# EasyEDA Pro project ProPrj_CH634X-PD-R0-1v1_2025-08-08(1).epro, schematic CH634X-PD-R0-1v1A
Board Name: CH634X-PD-R0-1v1A; Create Date: 2025-07-20; Page Name: CH634X-PD-R0-1v1A; Project Name: CH634X-PD-R0-1v1A; Schematic Name: CH634X-PD-R0-1v1A; Update Date: 2025-08-05; Address1: *; Address2: *; Address3: *; Address4: *; Application_BuildNumber: *; ApprovedBy: *; Author: *; CheckedBy: *; CompanyName: *; CurrentDate: *; CurrentTime: *; Date: *; DocumentFullPathAndName: *; DocumentName: *; DocumentNumber: *; DrawnBy: *; Engineer: *; ImagePath: *; ModifiedDate: *; Organization: *; ProjectName: *; Revision: *; Rule: *; SheetNumber: *; SheetTotal: *; Time: *; Title: *
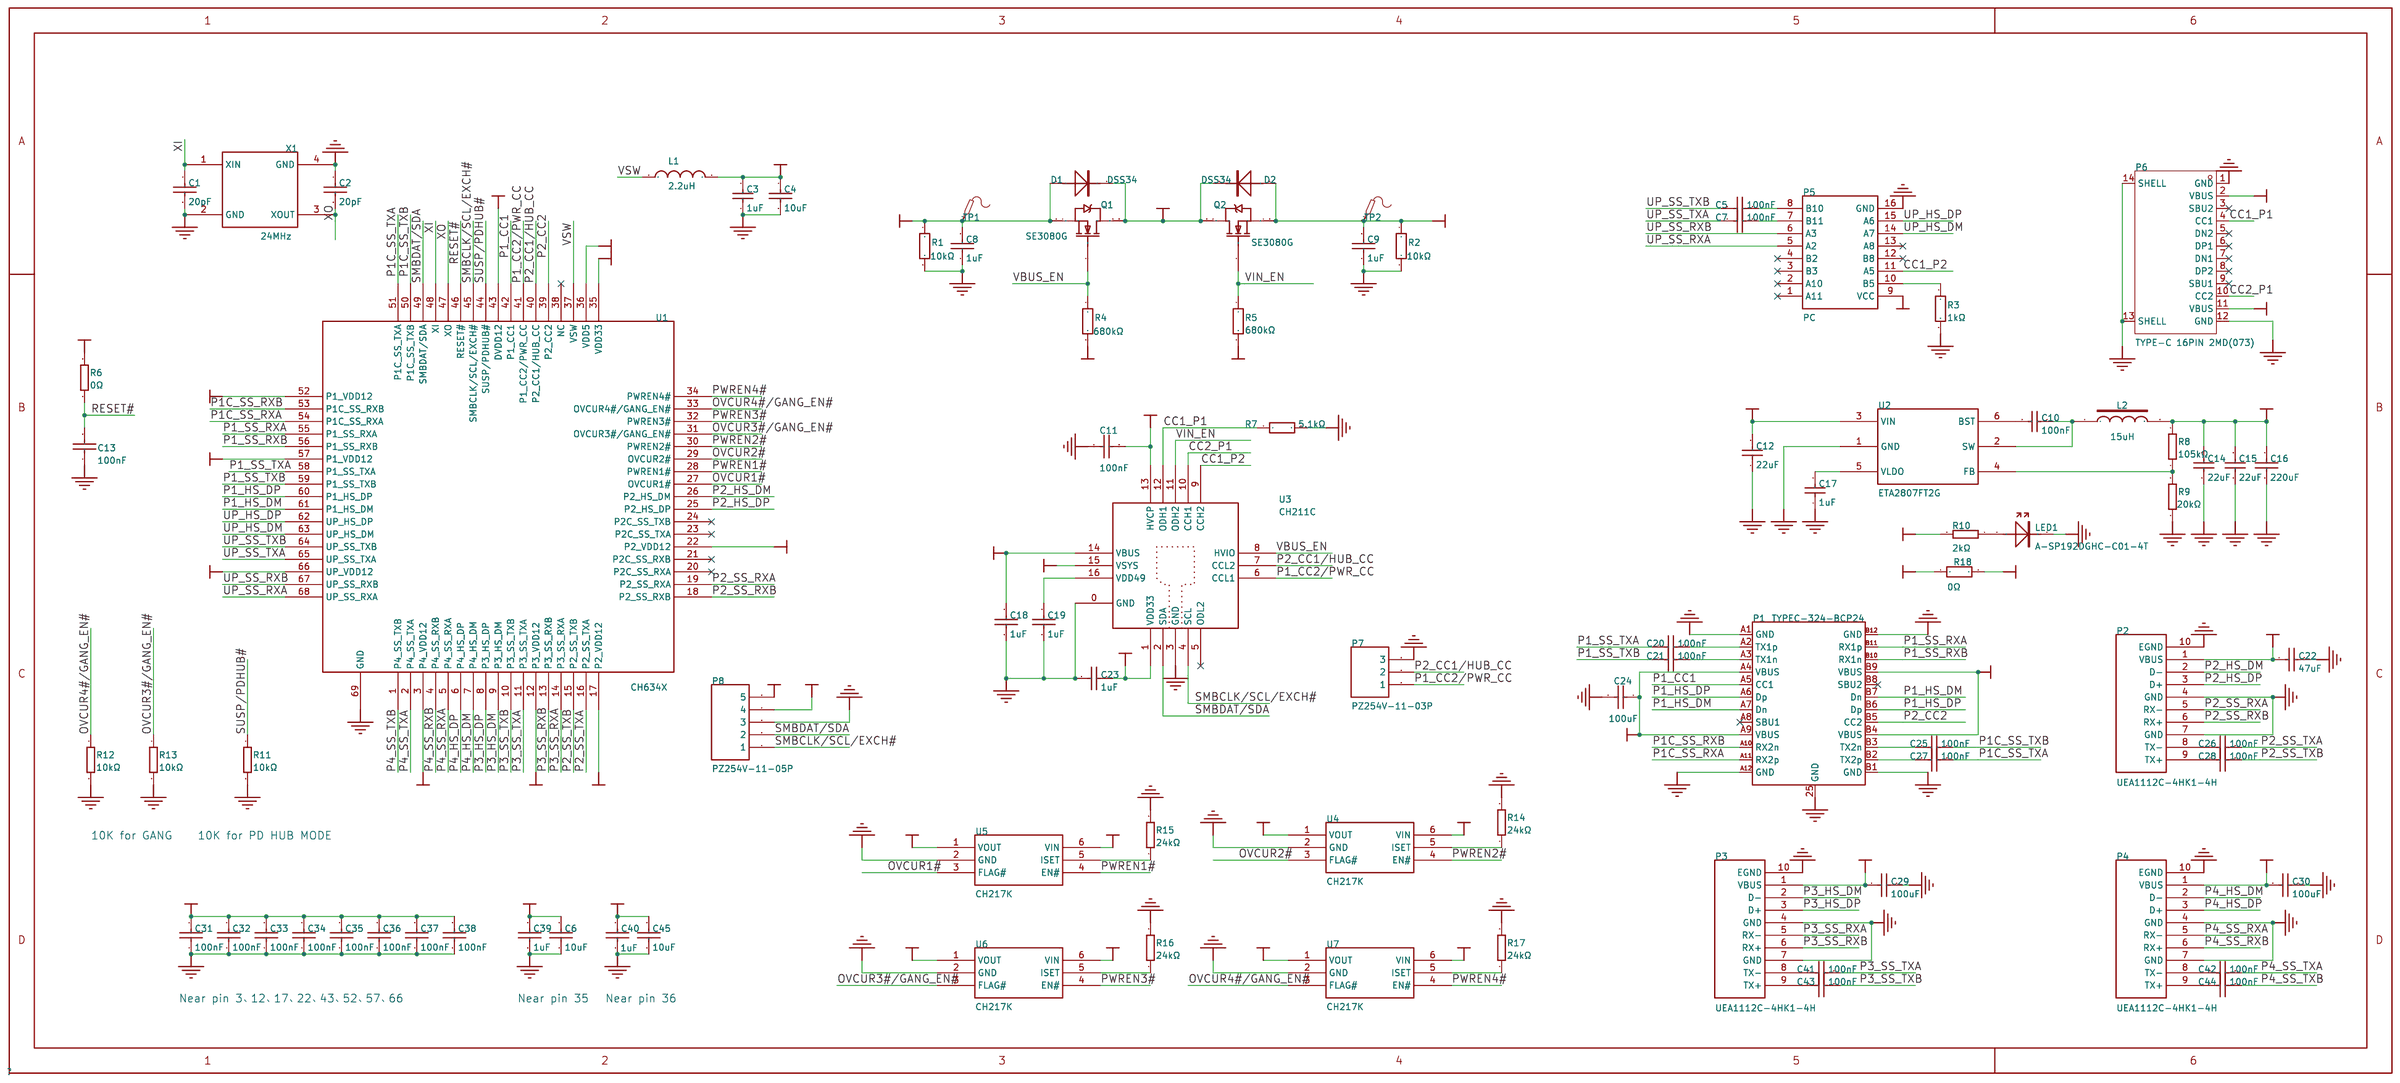
[diagram p0: schematic sheet]

## Parts
C1  20pF  [C0402]
C2  20pF  [C0402]
C3  1uF  [C0402]
C4  10uF  [C0603]
C5  100nF  [C0402]
C6  10uF  [C0603]
C7  100nF  [C0402]
C8  1uF  [C0402]
C9  1uF  [C0402]
C10  100nF  [C0402]
C11  100nF  [C0402]
C12  22uF  [C0805]
C13  100nF  [C0402]  (no BOM)
C14  22uF  [C0805]
C15  22uF  [C0805]
C16  220uF  [CAP-TH_BD6.3-P2.50-D0.6-FD-1]
C17  1uF  [C0402]
C18  1uF  [C0402]
C19  1uF  [C0402]
C20  100nF  [C0402]
C21  100nF  [C0402]
C22  47uF  [C1206]
C23  1uF  [C0402]
C24  100uF  [CAP-TH_BD5.0-P2.00-D0.8-FD]
C25  100nF  [C0402]
C26  100nF  [C0402]
C27  100nF  [C0402]
C28  100nF  [C0402]
C29  100uF  [CAP-TH_BD5.0-P2.00-D0.8-FD]
C30  100uF  [CAP-TH_BD5.0-P2.00-D0.8-FD]
C31  100nF  [C0402]
C32  100nF  [C0402]
C33  100nF  [C0402]
C34  100nF  [C0402]
C35  100nF  [C0402]
C36  100nF  [C0402]
C37  100nF  [C0402]
C38  100nF  [C0402]
C39  1uF  [C0402]
C40  1uF  [C0402]
C41  100nF  [C0402]
C42  100nF  [C0402]
C43  100nF  [C0402]
C44  100nF  [C0402]
C45  10uF  [C0603]
D1  DSS34  [SOD-123FL_L2.7-W1.8-LS3.8-RD]
D2  DSS34  [SOD-123FL_L2.7-W1.8-LS3.8-RD]
L1  2.2uH  [IND-SMD_L3.0-W3.0_FNR30XXS]
L2  15uH  [IND-SMD_L7.1-W6.6]
LED1  A-SP192DGHC-C01-4T  [LED0603-FD]
P1  TYPEC-324-BCP24  [USB-C-SMD_TYPEC-324-BCP24]
P2  UEA1112C-4HK1-4H  [USB-3.0-TH_UEA1112C-4HK1-4H]
P3  UEA1112C-4HK1-4H  [USB-3.0-TH_UEA1112C-4HK1-4H]
P4  UEA1112C-4HK1-4H  [USB-3.0-TH_UEA1112C-4HK1-4H]
P5  PC  [CABLE-TYPEC1]
P6  TYPE-C 16PIN 2MD(073)  [USB-C-SMD_TYPE-C-6PIN-2MD-073]
P7  PZ254V-11-03P  [HDR-TH_3P-P2.54-V-M]
P8  PZ254V-11-05P  [HDR-TH_5P-P2.54-V-M]
Q1  SE3080G  [PDFN-8_L5.8-W4.9-P1.27-LS6.1-BL]
Q2  SE3080G  [PDFN-8_L5.8-W4.9-P1.27-LS6.1-BL]
R1  10kΩ  [R0402]
R2  10kΩ  [R0402]
R3  1kΩ  [R0402]
R4  680kΩ  [R0402]
R5  680kΩ  [R0402]
R6  0Ω  [R0402]
R7  5.1kΩ  [R0402]
R8  105kΩ  [R0402]
R9  20kΩ  [R0402]
R10  2kΩ  [R0402]
R11  10kΩ  [R0402]
R12  10kΩ  [R0402]  (no BOM)
R13  10kΩ  [R0402]  (no BOM)
R14  24kΩ  [R0402]
R15  24kΩ  [R0402]
R16  24kΩ  [R0402]
R17  24kΩ  [R0402]
R18  0Ω  [R0402]  (no BOM)
TP1  -  [Test-Point-0.5mm]
TP2  -  [Test-Point-0.5mm]
U1  CH634X  [QFN-68_L8.0-W8.0-P0.40-TL-EP5.5]
U2  ETA2807FT2G  [TSOT-23-6_L2.9-W1.6-P0.95-LS2.8-BL]
U3  CH211C  [QFN16C_2X2]
U4  CH217K  [SOT-23-6_L2.9-W1.6-P0.95-LS2.8-BL]
U5  CH217K  [SOT-23-6_L2.9-W1.6-P0.95-LS2.8-BL]
U6  CH217K  [SOT-23-6_L2.9-W1.6-P0.95-LS2.8-BL]
U7  CH217K  [SOT-23-6_L2.9-W1.6-P0.95-LS2.8-BL]
X1  24MHz  [CRYSTAL-SMD_4P-L3.2-W2.5-BL]

## Library data of the parts
C1 C2 = GCM1555C1H200FA16D: 容值:20pF;精度:±1%;额定电压:50V;材质(温度系数):C0G;; LCSC Part Name: 20pF ±1% 50V; Supplier Part: C437436; Manufacturer: muRata(村田); Supplier Footprint: 0402; JLCPCB Part Class: Extended Part; Datasheet: https://atta.szlcsc.com/upload/public/pdf/source/20191226/C475964_3FAF76C90CD8FFB09F50C7480ADA926F.pdf; Supplier: LCSC; Tolerance: ±1%; Voltage Rated: 50V; Temperature Coefficient: C0G
C3 C8 C9 C17-C19 C23 C39 C40 = CL05A105KA5NQNC: 容值:1uF;精度:±10%;额定电压:25V;材质(温度系数):X5R;; LCSC Part Name: 1uF ±10% 25V; Supplier Part: C52923; Manufacturer: SAMSUNG(三星); Supplier Footprint: 0402; JLCPCB Part Class: Basic Part; Datasheet: https://atta.szlcsc.com/upload/public/pdf/source/20160218/1457707763339.pdf; Supplier: LCSC; Tolerance: ±10%; Voltage Rated: 25V; Temperature Coefficient: X5R
C4 C6 C45 = CGA0603X5R106K100JT: 容值:10uF;精度:±10%;额定电压:10V;温度系数:X5R;; LCSC Part Name: 10uF ±10% 10V; Supplier Part: C6119842; Manufacturer: HRE(芯声); Supplier Footprint: 0603; JLCPCB Part Class: Extended Part; Supplier: LCSC; Tolerance: ±10%; Voltage Rating: 10V; Temperature Coefficient: X5R
C5 C7 C10 C11 C13 C20 C21 C25-C28 C31-C38 C41-C44 = CL05B104KO5NNNC: 容值:100nF;精度:±10%;额定电压:16V;材质(温度系数):X7R;; LCSC Part Name: 100nF ±10% 16V; Supplier Part: C1525; Manufacturer: SAMSUNG(三星); Supplier Footprint: 0402; JLCPCB Part Class: Basic Part; Datasheet: https://atta.szlcsc.com/upload/public/pdf/source/20160218/1457707763339.pdf; Supplier: LCSC; Tolerance: ±10%; Voltage Rated: 16V; Temperature Coefficient: X7R
C12 C14 C15 = CGA0805X5R226M350MT: 容值:22uF;精度:±20%;额定电压:35V;材质(温度系数):X5R;; LCSC Part Name: 22uF ±20% 35V; Supplier Part: C6119901; Manufacturer: HRE(芯声); Supplier Footprint: 0805; JLCPCB Part Class: Extended Part; Datasheet: https://atta.szlcsc.com/upload/public/pdf/source/20231129/D589D0CC4D260F7AC3A77E53B455CCB3.pdf; Supplier: LCSC; Tolerance: ±20%; Voltage Rated: 35V; Temperature Coefficient: X5R
C16 = PA25V220M6x8: 容值:220uF;精度:±20%;额定电压:25V;纹波电流:2.9A@100Hz;等效串联电阻(ESR):25mΩ@100kHz;类型:-;; LCSC Part Name: 220uF ±20% 25V; Supplier Part: C46550441; Manufacturer: 捷而瑞; Supplier Footprint: 插件,D6.3xL8mm; JLCPCB Part Class: Extended Part; Datasheet: https://atta.szlcsc.com/upload/public/pdf/source/20250307/831193F737CAF6D75AC25F14E955F0EC.pdf; Supplier: LCSC; Tolerance: ±20%; Voltage Rating: 25V; Ripple Current: 2.9A@100Hz; Equivalent Series Resistance(ESR): 25mΩ@100kHz; Diameter: 6.3mm; Height - Seated (Max): 8mm; Lifetime: 2000hrs@105℃; Operating Temperature: -55℃~+105℃
C22 = HGC1206R5476M250NSPJ: 容值:47uF;精度:±20%;额定电压:25V;温度系数:X5R;; LCSC Part Name: 47uF ±20% 25V; Supplier Part: C22367835; Manufacturer: Chinocera(华瓷); Supplier Footprint: 1206; JLCPCB Part Class: Extended Part; Datasheet: https://atta.szlcsc.com/upload/public/pdf/source/20240326/E6CB0DC43BB858B74F4352229FABFDCA.pdf; Supplier: LCSC; Tolerance: ±20%; Voltage Rating: 25V; Temperature Coefficient: X5R
C24 C29 C30 = KS107M016D07RR0VH2FP0: 容值:100uF;精度:±20%;额定电压:16V;纹波电流:-;等效串联电阻:-;; LCSC Part Name: 100uF ±20% 16V; Supplier Part: C43803; Manufacturer: CX(承兴); Supplier Footprint: 插件,D5xL7mm; JLCPCB Part Class: Extended Part; Datasheet: https://atta.szlcsc.com/upload/public/pdf/source/20230817/0DB19D47181DB7F2222DAA6444591EF5.pdf; Supplier: LCSC; Tolerance: ±20%; Rated Voltage: 16V; Lead Spacing: 2mm; φD: 5mm; L: 7mm; Lifetime @ Temp: 1000hrs@105℃; Operating Temperature: -40℃~+105℃
D1 D2 = DSS34_C511866: 正向压降(Vf):550mV@3A;直流反向耐压(Vr):40V;整流电流:3A;; LCSC Part Name: 电压:40V 电流:3A; Supplier Part: C511866; Manufacturer: BORN(伯恩半导体); Supplier Footprint: SOD-123FL; JLCPCB Part Class: Extended Part; Datasheet: https://atta.szlcsc.com/upload/public/pdf/source/20231213/A35D7F17905BC063B6E854915CEDE7F7.pdf; Supplier: LCSC; Forward Voltage (Vf@If): 550mV@3A; Reverse Voltage (Vr): 40V; Rectified Current: 3A
L1 = FNR3015S2R2MT: 电感值:2.2uH;精度:±20%;额定电流:2A;饱和电流(Isat):2A;; LCSC Part Name: 2.2uH ±20% 2A; Supplier Part: C167747; Manufacturer: cjiang(长江微电); Supplier Footprint: SMD,3x3mm; JLCPCB Part Class: Extended Part; Datasheet: https://atta.szlcsc.com/upload/public/pdf/source/20190327/C167925_9EFF0AABC4CA629C2CC95961DBF7D39D.pdf; Supplier: LCSC; Tolerance: ±20%; Rated Current: 2A; Saturation Current (Isat): 2A; DC Resistance (DCR): 78mΩ
L2 = SMMS0650-150M: 电感值:15uH;精度:±20%;额定电流:3.1A;饱和电流(Isat):5A;类型:-;; LCSC Part Name: 15uH ±20% 5A; Supplier Part: C149585; Manufacturer: SXN(顺翔诺); Supplier Footprint: SMD,6.6x7.1mm; JLCPCB Part Class: Extended Part; Datasheet: https://atta.szlcsc.com/upload/public/pdf/source/20210810/BBF24330FB2F5029F637830BA9C42C0D.pdf; Supplier: LCSC; Tolerance: ±20%; Current Rating: 3.1A; Current - Saturation(Isat): 5A; DC Resistance(DCR): 85mΩ
LED1 = A-SP192DGHC-C01-4T: 发光颜色:绿色;正向电压(VF):2.4V~3V;功率:70mW;主波长:520nm~535nm;透镜颜色:无色透明透镜;发光强度:225mcd~450mcd;发光角度:120°;载带方式:正贴;工作温度:-40℃~+85℃;; LCSC Part Name: 0603高亮绿灯正贴; Supplier Part: C19171301; Manufacturer: Amicc(欧密格光电); Supplier Footprint: 0603; JLCPCB Part Class: Extended Part; Datasheet: https://atta.szlcsc.com/upload/public/pdf/source/20231108/CAA90604E374CB6B31BBE970B55159E7.pdf; Supplier: LCSC; Emitted Color: 绿色; Forward Voltage (VF): 2.4V~3V; Power Dissipation: 70mW; Dominant Wavelength: 520nm~535nm; Lens Color: 无色透明透镜; Luminous Intensity: 225mcd~450mcd; Viewing Angle: 120°; Mounting Sytle: 正贴; Operating Temperature: -40℃~+85℃
P1 = TYPEC-324-BCP24: 连接器类型:Type-C;标准:USB 3.1;公母:母;端口数量:1;触点数量:24P;安装方式:卧贴;额定电流 - 电源:5A;工作温度范围:-45℃~+85℃;焊接温度(最大值):260℃;; LCSC Part Name: Type-C 母 卧贴; Supplier Part: C2835314; Manufacturer: XUNPU(讯普); Supplier Footprint: SMD; JLCPCB Part Class: Extended Part; Datasheet: https://atta.szlcsc.com/upload/public/pdf/source/20210528/C2835314_2977690A256D083E1F696B82A85B6553.pdf; Supplier: LCSC; Connector Type: Type-C; Standard: USB 3.1; Gender: 母; Number of Ports: 1; Number of Contacts: 24P; Mounting Style: 卧贴; Current Rating - Power (Max): 5A; Operating Temperature Range: -45℃~+85℃; Soldering Temperature(Max): 260℃
P2-P4 = UEA1112C-4HK1-4H: 连接器类型:Type-A;标准:USB 3.0;公母:母;端口数量:1;触点数量:9P;安装方式:弯插;额定电流 - 电源:-;工作温度范围:-;; LCSC Part Name: Type-A 母 弯插; Supplier Part: C225737; Manufacturer: FOXCONN(富士康); Supplier Footprint: 插件; JLCPCB Part Class: Extended Part; Datasheet: https://atta.szlcsc.com/upload/public/pdf/source/20190123/C225737_436E4C0866C11E376D1F0D74A54FF2F5.pdf; Supplier: LCSC; Connector Type: Type-A; Standard: USB 3.0; Gender: 母; Number of Ports: 1; Number of Contacts: 9P; Mounting Style: 弯插
P5 = PC: Design Item ID: TypeC-Cable1; Library Name: wch_sch_others
P6 = TYPE-C 16PIN 2MD(073): 连接器类型:Type-C;协议标准:USB 3.1;公母:母;安装方式:卧贴;触点数量:16P;端口数量:1;额定电流 - 电源:3A;工作温度:-25℃~+85℃;; LCSC Part Name: Type-C 母 卧贴; Supplier Part: C2765186; Manufacturer: SHOU HAN(首韩); Supplier Footprint: SMD; JLCPCB Part Class: Extended Part; Datasheet: https://atta.szlcsc.com/upload/public/pdf/source/20250506/FFB74EDFDFA0AC372CE4A8E4F739CCEF.pdf; Supplier: LCSC; Connector Type: Type-C; Protocol Standard: USB 3.1; Gender: 母; Mounting Type: 卧贴; Number of Contacts: 16P; Number of Ports: 1; Current Rating-Power: 3A; Voltage Rating: 5V; Connect-Disconnect Life: 5千次; Detection color: 黑色; Operating Temperature: -25℃~+85℃
P7 = PZ254V-11-03P: 插针结构:1x3P;间距:2.54mm;行距:-;圆针/方针:方针;安装方式:直插;排数:单排;总PIN位数:3P;额定电流:3A;额定电压:250V;配合针长度:6mm;塑高:2.5mm;端接针长度:3mm;工作温度:-40℃~+105℃;颜色:黑色;; LCSC Part Name: 1x3P 间距:2.54mm 方针 直插; Supplier Part: C2937625; Manufacturer: XFCN(兴飞); Supplier Footprint: 插件,P=2.54mm; JLCPCB Part Class: Extended Part; Datasheet: https://atta.szlcsc.com/upload/public/pdf/source/20200309/C492402_8335C3D49C4E4C618838D59BB1D024C1.pdf; Supplier: LCSC; Pin Structure: 1x3P; Pitch: 2.54mm; Circluar Pins/Square Pins: 方针; Mounting Type: 直插; Number of Rows: 单排; Number of Pins: 3P; Current Rating: 3A; Voltage Rating (Max): 250V; Length of Mating Pin: 6mm; Insulation Height: 2.5mm; Length of End Connection Pin: 3mm; Operating Temperature: -40℃~+105℃; Color: 黑色
P8 = PZ254V-11-05P: 插针结构:1x5P;间距:2.54mm;行距:-;圆针/方针:方针;安装方式:直插;排数:单排;总PIN位数:5P;额定电流:-;额定电压:-;配合针长度:6mm;塑高:2.5mm;端接针长度:3mm;触头材质:黄铜;触头镀层:-;工作温度:-40℃~+105℃;颜色:黑色;; LCSC Part Name: 1x5P 间距:2.54mm 方针 直插; Supplier Part: C492404; Manufacturer: XFCN(兴飞); Supplier Footprint: 插件,P=2.54mm; JLCPCB Part Class: Extended Part; Datasheet: https://atta.szlcsc.com/upload/public/pdf/source/20200309/C492404_E51533260F8710EFF5D4617281164C1D.pdf; Supplier: LCSC; Pin Structure: 1x5P; Pitch: 2.54mm; Circluar Pins/Square Pins: 方针; Mounting Type: 直插; Number of Rows: 单排; Number of Pins: 5P; Length of Mating Pin: 6mm; Insulation Height: 2.5mm; Length of End Connection Pin: 3mm; Contact Material: 黄铜; Operating Temperature: -40℃~+105℃; Color: 黑色
Q1 Q2 = SE3080G: 类型:1个N沟道;漏源电压(Vdss):30V;连续漏极电流(Id):80A;导通电阻(RDS(on)@Vgs,Id):6.5mΩ@10V,25A;功率:83W;阈值电压(Vgs(th)@Id):3V@250uA;; LCSC Part Name: 1个N沟道 耐压:30V 电流:80A; Supplier Part: C238669; Manufacturer: SINO-IC(光宇睿芯); Supplier Footprint: PDFN-8(4.9x5.8); JLCPCB Part Class: Extended Part; Datasheet: https://atta.szlcsc.com/upload/public/pdf/source/20180713/C238674_6C56EA46448BCBD4B54822B447B9A2ED.pdf; Supplier: LCSC; Type: 1个N沟道; Drain Source Voltage (Vdss): 30V; Continuous Drain Current (Id): 80A; Drain Source On Resistance (RDS(on)@Vgs,Id): 6.5mΩ@10V,25A; Power Dissipation (Pd): 83W; Gate Threshold Voltage (Vgs(th)@Id): 3V@250uA
R1 R2 R11-R13 = 0402WGF1002TCE: 电阻类型:厚膜电阻;阻值:10kΩ;精度:±1%;功率:62.5mW;最大工作电压:50V;温度系数:±100ppm/℃;; LCSC Part Name: 10kΩ ±1% 62.5mW 厚膜电阻; Supplier Part: C25744; Manufacturer: UNI-ROYAL(厚声); Supplier Footprint: 0402; JLCPCB Part Class: Basic Part; Datasheet: https://atta.szlcsc.com/upload/public/pdf/source/20200306/C422600_1E6D84923E4A46A82E41ADD87F860B5C.pdf; Supplier: LCSC; Type: 厚膜电阻; Tolerance: ±1%; Power(Watts): 62.5mW; Overload Voltage (Max): 50V; Temperature Coefficient: ±100ppm/℃; Operating Temperature Range: -55℃~+155℃
R3 = 0402WGF1001TCE: 电阻类型:厚膜电阻;阻值:1kΩ;精度:±1%;功率:62.5mW;最大工作电压:50V;温度系数:±100ppm/℃;; LCSC Part Name: 1kΩ ±1% 62.5mW 厚膜电阻; Supplier Part: C11702; Manufacturer: UNI-ROYAL(厚声); Supplier Footprint: 0402; JLCPCB Part Class: Basic Part; Datasheet: https://atta.szlcsc.com/upload/public/pdf/source/20200306/C422600_1E6D84923E4A46A82E41ADD87F860B5C.pdf; Supplier: LCSC; Type: 厚膜电阻; Tolerance: ±1%; Power(Watts): 62.5mW; Overload Voltage (Max): 50V; Temperature Coefficient: ±100ppm/℃; Operating Temperature Range: -55℃~+155℃
R4 R5 = FRC0402F6803TS: 电阻类型:厚膜电阻;阻值:680kΩ;精度:±1%;功率:62.5mW;工作电压:50V;温度系数:±100ppm/℃;; LCSC Part Name: 680kΩ ±1% 62.5mW 厚膜电阻; Supplier Part: C2909377; Manufacturer: FOJAN(富捷); Supplier Footprint: 0402; JLCPCB Part Class: Extended Part; Datasheet: https://atta.szlcsc.com/upload/public/pdf/source/20211221/925EC7D7225764EE0046F22065062C87.pdf; Supplier: LCSC; Type: 厚膜电阻; Tolerance: ±1%; Power(Watts): 62.5mW; Voltage-Supply(Max): 50V; Temperature Coefficient: ±100ppm/℃; Operating Temperature: -55℃~+155℃
R6 R18 = 0402WGF0000TCE: 电阻类型:厚膜电阻;阻值:0Ω;精度:±1%;功率:62.5mW;最大工作电压:50V;温度系数:±800ppm/℃;; LCSC Part Name: 0Ω ±1% 62.5mW 厚膜电阻; Supplier Part: C17168; Manufacturer: UNI-ROYAL(厚声); Supplier Footprint: 0402; JLCPCB Part Class: Basic Part; Datasheet: https://atta.szlcsc.com/upload/public/pdf/source/20200306/C422600_1E6D84923E4A46A82E41ADD87F860B5C.pdf; Supplier: LCSC; Type: 厚膜电阻; Tolerance: ±1%; Power(Watts): 62.5mW; Overload Voltage (Max): 50V; Temperature Coefficient: ±800ppm/℃; Operating Temperature Range: -55℃~+155℃
R7 = FRC0402F5101TS: 电阻类型:厚膜电阻;阻值:5.1kΩ;精度:±1%;功率:62.5mW;最大工作电压:50V;温度系数:±100ppm/℃;; LCSC Part Name: 5.1kΩ ±1% 62.5mW 厚膜电阻; Supplier Part: C2906874; Manufacturer: FOJAN(富捷); Supplier Footprint: 0402; JLCPCB Part Class: Extended Part; Datasheet: https://atta.szlcsc.com/upload/public/pdf/source/20211221/925EC7D7225764EE0046F22065062C87.pdf; Supplier: LCSC; Type: 厚膜电阻; Tolerance: ±1%; Power(Watts): 62.5mW; Overload Voltage (Max): 50V; Temperature Coefficient: ±100ppm/℃; Operating Temperature Range: -55℃~+155℃
R8 = FRC0402F1053TS: 电阻类型:厚膜电阻;阻值:105kΩ;精度:±1%;功率:62.5mW;工作电压:50V;温度系数:±100ppm/℃;; LCSC Part Name: 105kΩ ±1% 62.5mW 厚膜电阻; Supplier Part: C2933067; Manufacturer: FOJAN(富捷); Supplier Footprint: 0402; JLCPCB Part Class: Extended Part; Datasheet: https://atta.szlcsc.com/upload/public/pdf/source/20211221/925EC7D7225764EE0046F22065062C87.pdf; Supplier: LCSC; Type: 厚膜电阻; Tolerance: ±1%; Power(Watts): 62.5mW; Voltage-Supply(Max): 50V; Temperature Coefficient: ±100ppm/℃; Operating Temperature: -55℃~+155℃
R9 = FRC0402F2002TS: 电阻类型:厚膜电阻;阻值:20kΩ;精度:±1%;功率:62.5mW;最大工作电压:50V;温度系数:±100ppm/℃;; LCSC Part Name: 20kΩ ±1% 62.5mW 厚膜电阻; Supplier Part: C2906867; Manufacturer: FOJAN(富捷); Supplier Footprint: 0402; JLCPCB Part Class: Extended Part; Datasheet: https://atta.szlcsc.com/upload/public/pdf/source/20211221/925EC7D7225764EE0046F22065062C87.pdf; Supplier: LCSC; Type: 厚膜电阻; Tolerance: ±1%; Power(Watts): 62.5mW; Overload Voltage (Max): 50V; Temperature Coefficient: ±100ppm/℃; Operating Temperature Range: -55℃~+155℃
R10 = FRC0402F2001TS: 电阻类型:厚膜电阻;阻值:2kΩ;精度:±1%;功率:62.5mW;最大工作电压:50V;温度系数:±100ppm/℃;; LCSC Part Name: 2kΩ ±1% 62.5mW 厚膜电阻; Supplier Part: C2909344; Manufacturer: FOJAN(富捷); Supplier Footprint: 0402; JLCPCB Part Class: Extended Part; Datasheet: https://atta.szlcsc.com/upload/public/pdf/source/20211221/925EC7D7225764EE0046F22065062C87.pdf; Supplier: LCSC; Type: 厚膜电阻; Tolerance: ±1%; Power(Watts): 62.5mW; Overload Voltage (Max): 50V; Temperature Coefficient: ±100ppm/℃; Operating Temperature Range: -55℃~+155℃
R14-R17 = FRC0402F2402TS: 电阻类型:厚膜电阻;阻值:24kΩ;精度:±1%;功率:62.5mW;工作电压:50V;温度系数:±100ppm/℃;; LCSC Part Name: 24kΩ ±1% 62.5mW 厚膜电阻; Supplier Part: C2933082; Manufacturer: FOJAN(富捷); Supplier Footprint: 0402; JLCPCB Part Class: Extended Part; Datasheet: https://atta.szlcsc.com/upload/public/pdf/source/20211221/925EC7D7225764EE0046F22065062C87.pdf; Supplier: LCSC; Type: 厚膜电阻; Tolerance: ±1%; Power(Watts): 62.5mW; Voltage-Supply(Max): 50V; Temperature Coefficient: ±100ppm/℃; Operating Temperature: -55℃~+155℃
TP1 TP2 = Test-Point: Test Point 测试点
U1 = CH634X: 4 ports USB 3.0 SS hub; Library Name: CHXXX
U2 = ETA2807FT2G_C22362744: 功能类型:降压型;工作电压:4.6V~35V;输出电流:3A;; LCSC Part Name: 35V/3A 同步降压转换器; Supplier Part: C22362744; Manufacturer: ETA(钰泰); Supplier Footprint: FCTSOT-23-6; JLCPCB Part Class: Extended Part; Datasheet: https://atta.szlcsc.com/upload/public/pdf/source/20240315/CDAF6648CB15A0C5531296274A699519.pdf; Supplier: LCSC; Function: 降压型; Voltage - Supply: 4.6V~35V; Output Current: 3A; Operating Temperature: -40℃~+85℃; Synchronous Rectifier: 是; Number of Outputs: 1; Switch tube (built-in/external): 内置
U3 = CH211D: CH211是内置高压开关和升压模块的Type-C/PD高压接口芯片，内置4通道高压开关，支持外部N型MOSFET功率管控制，提供2线控制接口及中断，可用于MCU管理Type-C接口电源和USB PD信号高压扩展等。; Supplier Part: C46527406; Manufacturer: WCH(南京沁恒); Supplier Footprint: QFN-20(3x3); Datasheet: https://atta.szlcsc.com/upload/public/pdf/source/20250305/BD9FD8E9CF69E02EE411EB91BA1C7B5B.pdf; Supplier: LCSC
U4-U7 = CH217K: 类型:负载开关;通道数:1;输入控制逻辑:低电平有效;输出电流:2.7A;工作电压:2.7V~5.5V;导通电阻:70mΩ;; LCSC Part Name: USB 限流配电开关芯片; Supplier Part: C7462749; Manufacturer: WCH(南京沁恒); Supplier Footprint: SOT-23-6; JLCPCB Part Class: Extended Part; Datasheet: https://atta.szlcsc.com/upload/public/pdf/source/20240614/C0960F2CAA1F151A0DBC53501BDEDFC6.pdf; Supplier: LCSC; Type: 负载开关; Number of Channels: 1; Control Input Logic: 低电平有效; Output Current: 2.7A; Voltage - Supply: 2.7V~5.5V; RDS(on): 70mΩ; Operating Temperature	-: -40℃~+85℃
X1 = X322524MOB4SI: 晶振类型:贴片晶振;频率:24MHz;常温频差:±10ppm;负载电容:12pF;频率稳定度:±20ppm;; LCSC Part Name: YSX321SL 24MHZ 4P 3225 12PF ±10PPM -40~85℃ (±20PPM); Supplier Part: C70590; Manufacturer: YXC(扬兴晶振); Supplier Footprint: SMD3225-4P; JLCPCB Part Class: Extended Part; Datasheet: https://atta.szlcsc.com/upload/public/pdf/source/20240329/19D5F850207469550BEB00D7DFEDBC7A.pdf; Supplier: LCSC; Type: 贴片晶振; Normal temperature Frequency Tolerance: ±10ppm; Load Capacitance: 12pF; Frequency Stability: ±20ppm; Operating Temperature: -40℃~+85℃

## Nets
DVDD12: C3.2 C4.1 C31.2 C32.2 C33.2 C34.2 C35.2 C36.2 C37.2 C38.2 L1.2 U1.3(P4_VDD12) U1.12(P3_VDD12) U1.17(P2_VDD12) U1.22(P2_VDD12) U1.43(DVDD12) U1.52(P1_VDD12) U1.57(P1_VDD12) U1.66(UP_VDD12)
GND: C1.2 C2.1 C3.1 C4.2 C6.2 C8.1 C9.1 C11.1 C12.1 C13.1 C14.1 C15.1 C16.2 C17.1 C18.2 C19.2 C22.2 C23.2 C24.2 C29.2 C30.2 C31.1 C32.1 C33.1 C34.1 C35.1 C36.1 C37.1 C38.1 C39.2 C40.1 C45.2 LED1.2(K) P1.25(GND) P1.A1(GND) P1.A12(GND) P1.B1(GND) P1.B12(GND) P2.4(GND) P2.7(GND) P2.10(EGND) P3.4(GND) P3.7(GND) P3.10(EGND) P4.4(GND) P4.7(GND) P4.10(EGND) P5.16(GND) P6.1(GND) P6.12(GND) P6.13(SHELL) P6.14(SHELL) P7.3 P8.3 R1.2 R2.2 R3.2 R7.2 R9.1 R11.2 R12.2 R13.2 R14.2 R15.2 R16.2 R17.2 U1.69(GND) U2.1(GND) U3.0(GND) U3.3(GND) U4.2(GND) U5.2(GND) U6.2(GND) U7.2(GND) X1.2(GND) X1.4(GND)
VBUS: C8.2 C18.1 D1.1(A) P5.9(VCC) Q1.1(S) Q1.2(S) Q1.3(S) R1.1 R18.1 TP1.1 U3.14(VBUS)
VBUS_EN: Q1.4(G) R4.1 U3.8(HVIO)
VBUS_OUT1: C24.1 P1.A4(VBUS) P1.A9(VBUS) P1.B4(VBUS) P1.B9(VBUS) U5.1(VOUT)
VBUS_OUT2: C22.1 P2.1(VBUS) U4.1(VOUT)
VBUS_OUT3: C29.1 P3.1(VBUS) U6.1(VOUT)
VBUS_OUT4: C30.1 P4.1(VBUS) U7.1(VOUT)
VDD5: C14.2 C15.2 C16.1 C40.2 C45.1 L2.2 P8.5 R8.2 R10.2 R18.2 U1.36(VDD5) U4.6(VIN) U5.6(VIN) U6.6(VIN) U7.6(VIN)
VDD33: C6.1 C23.1 C39.1 P8.4 R6.2 U1.35(VDD33) U3.1(VDD33)
VIN: C9.2 D2.1(A) P6.2(VBUS) P6.11(VBUS) Q2.1(S) Q2.2(S) Q2.3(S) R2.1 TP2.1 U3.15(VSYS)
VIN_EN: Q2.4(G) R5.1 U3.11(ODH2)
CC1_P1: P6.4(CC1) R7.1 U3.12(ODH1)
CC1_P2: P5.11(A5) U3.9(CCH2)
CC2_P1: P6.10(CC2) U3.10(CCH1)
HVCP: C11.2 R4.2 R5.2 U3.13(HVCP)
OVCUR1#: U1.27(OVCUR1#) U5.3(FLAG#)
OVCUR2#: U1.29(OVCUR2#) U4.3(FLAG#)
OVCUR3#/GANG_EN#: R13.1 U1.31(OVCUR3#/GANG_EN#) U6.3(FLAG#)
OVCUR4#/GANG_EN#: R12.1 U1.33(OVCUR4#/GANG_EN#) U7.3(FLAG#)
P1_CC1: P1.A5(CC1) U1.42(P1_CC1)
P1_CC2/PWR_CC: P7.1 U1.41(P1_CC2/PWR_CC) U3.6(CCL1)
P1_HS_DM: P1.A7(Dn) P1.B7(Dn) U1.61(P1_HS_DM)
P1_HS_DP: P1.A6(Dp) P1.B6(Dp) U1.60(P1_HS_DP)
P1_SS_RXA: P1.B11(RX1p) U1.55(P1_SS_RXA)
P1_SS_RXB: P1.B10(RX1n) U1.56(P1_SS_RXB)
P1_SS_TXA: C20.1 U1.58(P1_SS_TXA)
P1_SS_TXB: C21.1 U1.59(P1_SS_TXB)
P1C_SS_RXA: P1.A11(RX2p) U1.54(P1C_SS_RXA)
P1C_SS_RXB: P1.A10(RX2n) U1.53(P1C_SS_RXB)
P1C_SS_TXA: C27.2 U1.51(P1C_SS_TXA)
P1C_SS_TXB: C25.2 U1.50(P1C_SS_TXB)
P2_CC1/HUB_CC: P7.2 U1.40(P2_CC1/HUB_CC) U3.7(CCL2)
P2_CC2: P1.B5(CC2) U1.39(P2_CC2)
P2_HS_DM: P2.2(D-) U1.26(P2_HS_DM)
P2_HS_DP: P2.3(D+) U1.25(P2_HS_DP)
P2_SS_RXA: P2.5(RX-) U1.19(P2_SS_RXA)
P2_SS_RXB: P2.6(RX+) U1.18(P2_SS_RXB)
P2_SS_TXA: C26.2 U1.16(P2_SS_TXA)
P2_SS_TXB: C28.2 U1.15(P2_SS_TXB)
P3_HS_DM: P3.2(D-) U1.9(P3_HS_DM)
P3_HS_DP: P3.3(D+) U1.8(P3_HS_DP)
P3_SS_RXA: P3.5(RX-) U1.14(P3_SS_RXA)
P3_SS_RXB: P3.6(RX+) U1.13(P3_SS_RXB)
P3_SS_TXA: C41.2 U1.11(P3_SS_TXA)
P3_SS_TXB: C43.2 U1.10(P3_SS_TXB)
P4_HS_DM: P4.2(D-) U1.7(P4_HS_DM)
P4_HS_DP: P4.3(D+) U1.6(P4_HS_DP)
P4_SS_RXA: P4.5(RX-) U1.5(P4_SS_RXA)
P4_SS_RXB: P4.6(RX+) U1.4(P4_SS_RXB)
P4_SS_TXA: C42.2 U1.2(P4_SS_TXA)
P4_SS_TXB: C44.2 U1.1(P4_SS_TXB)
PWREN1#: U1.28(PWREN1#) U5.4(EN#)
PWREN2#: U1.30(PWREN2#) U4.4(EN#)
PWREN3#: U1.32(PWREN3#) U6.4(EN#)
PWREN4#: U1.34(PWREN4#) U7.4(EN#)
RESET#: C13.2 R6.1 U1.46(RESET#)
SMBCLK/SCL/EXCH#: P8.1 U1.45(SMBCLK/SCL/EXCH#) U3.4(SCL)
SMBDAT/SDA: P8.2 U1.49(SMBDAT/SDA) U3.2(SDA)
SUSP/PDHUB#: R11.1 U1.44(SUSP/PDHUB#)
UP_HS_DM: P5.14(A7) U1.63(UP_HS_DM)
UP_HS_DP: P5.15(A6) U1.62(UP_HS_DP)
UP_SS_RXA: P5.5(A2) U1.68(UP_SS_RXA)
UP_SS_RXB: P5.6(A3) U1.67(UP_SS_RXB)
UP_SS_TXA: C7.1 U1.65(UP_SS_TXA)
UP_SS_TXB: C5.1 U1.64(UP_SS_TXB)
VHV: C12.2 D1.2(K) D2.2(K) Q1.5(D) Q1.6(D) Q1.7(D) Q1.8(D) Q2.5(D) Q2.6(D) Q2.7(D) Q2.8(D) U2.3(VIN)
VSW: L1.1 U1.37(VSW)
XI: C1.1 U1.48(XI) X1.1(XIN)
XO: C2.2 U1.47(XO) X1.3(XOUT)
$1N60: C21.2 P1.A3(TX1n)
$1N61: C20.2 P1.A2(TX1p)
$1N64: C27.1 P1.B2(TX2p)
$1N65: C25.1 P1.B3(TX2n)
$1N89: R14.1 U4.5(ISET)
$1N95: R15.1 U5.5(ISET)
$1N101: R17.1 U7.5(ISET)
$1N107: R16.1 U6.5(ISET)
$1N150: P5.10(B5) R3.1
$1N151: C7.2 P5.7(B11)
$1N152: C5.2 P5.8(B10)
$1N160: R8.1 R9.2 U2.4(FB)
$1N163: C10.1 L2.1 U2.2(SW)
$1N165: C17.2 U2.5(VLDO)
$1N186: C19.1 U3.16(VDD49)
$1N1769: C41.1 P3.8(TX-)
$1N1770: C43.1 P3.9(TX+)
$1N1773: C42.1 P4.8(TX-)
$1N1774: C44.1 P4.9(TX+)
$1N1801: LED1.1(A) R10.1
$1N1802: C10.2 U2.6(BST)
$1N1819: C26.1 P2.8(TX-)
$1N1820: C28.1 P2.9(TX+)

Not connected (* = marked no-connect by the designer): P1 A8(SBU1)* B8(SBU2)*; P5 1(A11)* 2(A10)* 3(B3)* 4(B2)* 12(B8)* 13(A8)*; P6 3(SBU2)* 5(DN2)* 6(DP1)* 7(DN1)* 8(DP2)* 9(SBU1)*; U1 20(P2C_SS_RXA)* 21(P2C_SS_RXB)* 23(P2C_SS_TXA)* 24(P2C_SS_TXB)* 38(NC)*; U3 5(ODL2)*

## Notes on the sheet
- 10K for GANG
- 10K for PD HUB MODE
- Near pin 3、12、17、22、43、52、57、66
- Near pin 35
- Near pin 36
